# EAGLE design PicoElfIO (EAGLE 4.11)
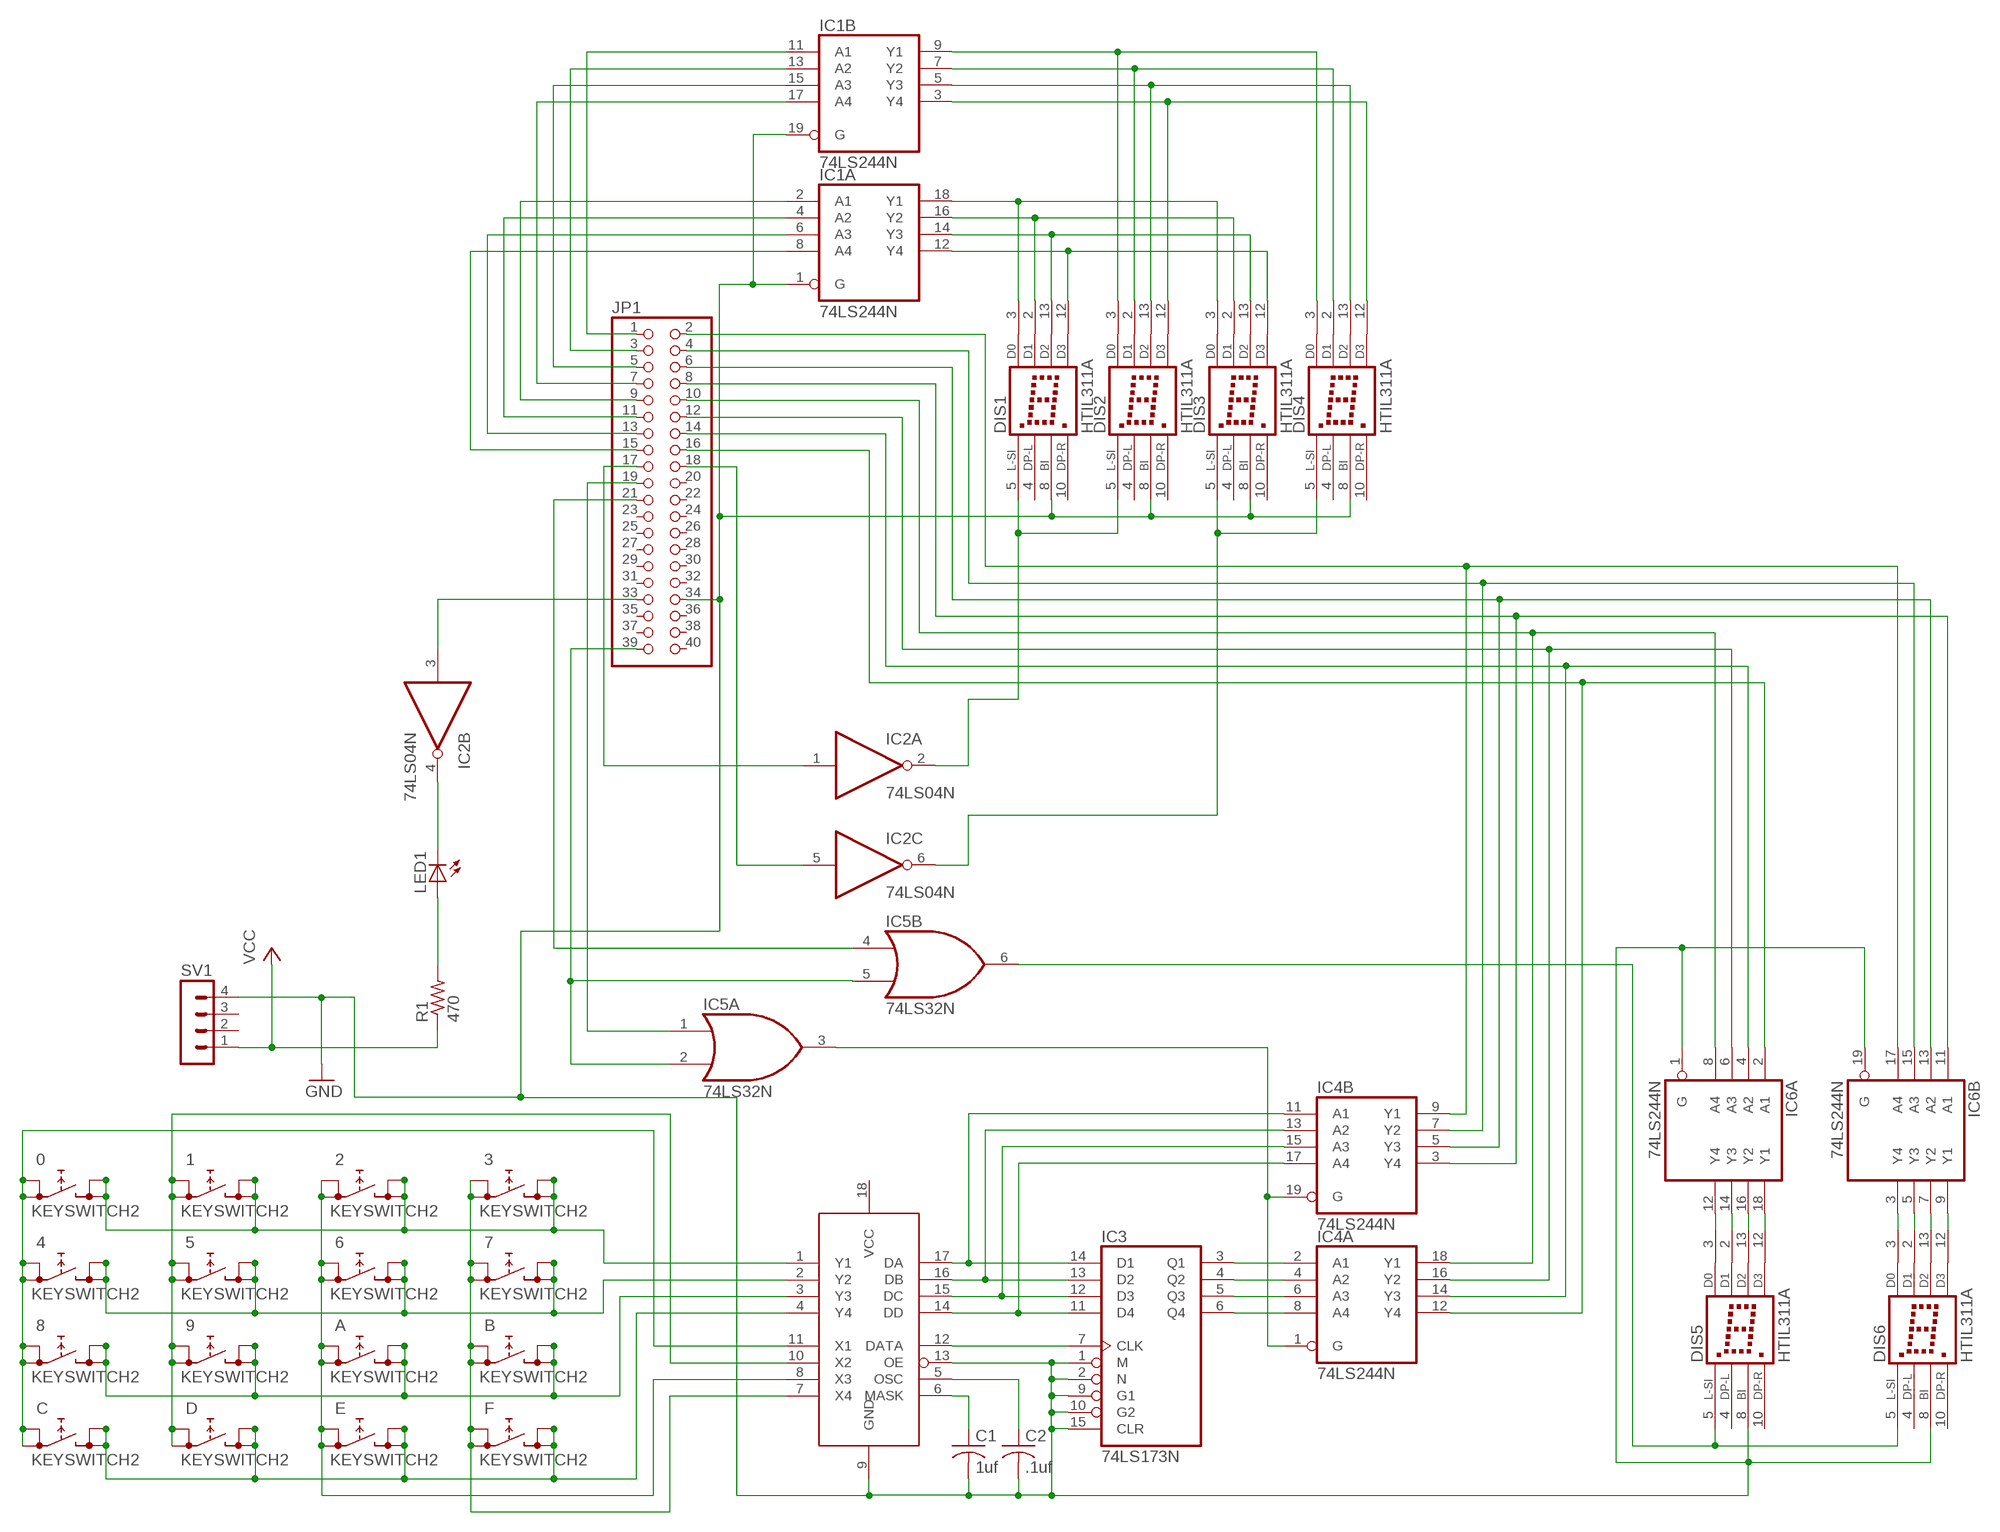
[diagram p0: schematic, sheet 1]

## Parts
0  KEYSWITCH2  [KEY2]
1  KEYSWITCH2  [KEY2]
2  KEYSWITCH2  [KEY2]
3  KEYSWITCH2  [KEY2]
4  KEYSWITCH2  [KEY2]
5  KEYSWITCH2  [KEY2]
6  KEYSWITCH2  [KEY2]
7  KEYSWITCH2  [KEY2]
8  KEYSWITCH2  [KEY2]
9  KEYSWITCH2  [KEY2]
A  KEYSWITCH2  [KEY2]
B  KEYSWITCH2  [KEY2]
C  KEYSWITCH2  [KEY2]
C1  1uf  C-US050-030X075  [C050-030X075]
C2  .1uf  C-US050-030X075  [C050-030X075]
D  KEYSWITCH2  [KEY2]
DIS1  HTIL311A  [HTIL311A]
DIS2  HTIL311A  [HTIL311A]
DIS3  HTIL311A  [HTIL311A]
DIS4  HTIL311A  [HTIL311A]
DIS5  HTIL311A  [HTIL311A]
DIS6  HTIL311A  [HTIL311A]
E  KEYSWITCH2  [KEY2]
F  KEYSWITCH2  [KEY2]
IC1  74LS244N  [DIL20]
IC2  74LS04N  [DIL14]
IC3  74LS173N  [DIL16]
IC4  74LS244N  [DIL20]
IC5  74LS32N  [DIL14]
IC6  74LS244N  [DIL20]
JP1  PINHD-2X20  [2X20]
LED1  LED5MM  [LED5MM]
R1  470  R-US_0204/5  [0204/5]
SV1  MA04-1  [MA04-1]
U$1  74C922  [DIL18]

## Nets
A0: IC1.11(B:A1) JP1.1
A1: IC1.13(B:A2) JP1.3
A2: IC1.15(B:A3) JP1.5
A3: IC1.17(B:A4) JP1.7
A4: IC1.2(A:A1) JP1.9
A5: IC1.4(A:A2) JP1.11
A6: IC1.6(A:A3) JP1.13
A7: IC1.8(A:A4) JP1.15
BA0: DIS2.3(D0) DIS4.3(D0) IC1.9(B:Y1)
BA1: DIS2.2(D1) DIS4.2(D1) IC1.7(B:Y2)
BA2: DIS2.13(D2) DIS4.13(D2) IC1.5(B:Y3)
BA3: DIS2.12(D3) DIS4.12(D3) IC1.3(B:Y4)
BA4: DIS1.3(D0) DIS3.3(D0) IC1.18(A:Y1)
BA5: DIS1.2(D1) DIS3.2(D1) IC1.16(A:Y2)
BA6: DIS1.13(D2) DIS3.13(D2) IC1.14(A:Y3)
BA7: DIS1.12(D3) DIS3.12(D3) IC1.12(A:Y4)
C0: 0.A0 0.A1 4.A0 4.A1 8.A0 8.A1 C.A0 C.A1 U$1.11(X1)
C1: 1.A0 1.A1 5.A0 5.A1 9.A0 9.A1 D.A0 D.A1 U$1.10(X2)
C2: 2.A0 2.A1 6.A0 6.A1 A.A0 A.A1 E.A0 E.A1 U$1.8(X3)
C3: 3.A0 3.A1 7.A0 7.A1 B.A0 B.A1 F.A0 F.A1 U$1.7(X4)
D0: IC4.9(B:Y1) IC6.17(B:A4) JP1.2
D1: IC4.7(B:Y2) IC6.15(B:A3) JP1.4
D2: IC4.5(B:Y3) IC6.13(B:A2) JP1.6
D3: IC4.3(B:Y4) IC6.11(B:A1) JP1.8
D4: IC4.18(A:Y1) IC6.8(A:A4) JP1.10
D5: IC4.16(A:Y2) IC6.6(A:A3) JP1.12
D6: IC4.14(A:Y3) IC6.4(A:A2) JP1.14
D7: IC4.12(A:Y4) IC6.2(A:A1) JP1.16
GND: C1.2 C2.2 DIS1.8(BI) DIS2.8(BI) DIS3.8(BI) DIS4.8(BI) DIS5.8(BI) DIS6.8(BI) IC1.1(A:G) IC1.19(B:G) IC3.1(M) IC3.2(N) IC3.9(G1) IC3.10(G2) IC3.15(CLR) IC6.1(A:G) IC6.19(B:G) JP1.34 SV1.4 U$1.9(GND) U$1.13(OE)
INP: IC5.1(A:I0) JP1.19
N$1: IC3.14(D1) IC4.11(B:A1) U$1.17(DA)
N$2: IC3.13(D2) IC4.13(B:A2) U$1.16(DB)
N$3: IC3.12(D3) IC4.15(B:A3) U$1.15(DC)
N$4: IC3.11(D4) IC4.17(B:A4) U$1.14(DD)
N$5: IC3.7(CLK) U$1.12(DATA)
N$6: IC2.4(B:O) LED1.K(C)
N$7: C1.1 U$1.6(MASK)
N$8: C2.1 U$1.5(OSC)
N$9: IC3.3(Q1) IC4.2(A:A1)
N$10: IC3.4(Q2) IC4.4(A:A2)
N$11: IC3.5(Q3) IC4.6(A:A3)
N$12: IC3.6(Q4) IC4.8(A:A4)
N$13: IC4.1(A:G) IC4.19(B:G) IC5.3(A:O)
N$14: DIS5.5(L-SI) DIS6.5(L-SI) IC5.6(B:O)
N$15: LED1.A R1.2
N$16: DIS5.3(D0) IC6.12(A:Y4)
N$17: DIS5.2(D1) IC6.14(A:Y3)
N$18: DIS5.13(D2) IC6.16(A:Y2)
N$19: DIS5.12(D3) IC6.18(A:Y1)
N$20: DIS6.3(D0) IC6.3(B:Y4)
N$21: DIS6.2(D1) IC6.5(B:Y3)
N$22: DIS6.13(D2) IC6.7(B:Y2)
N$23: DIS6.12(D3) IC6.9(B:Y1)
N$24: IC2.3(B:I) JP1.33
OUT: IC5.4(B:I0) JP1.21
PORT4: IC5.2(A:I1) IC5.5(B:I1) JP1.39
R0: 0.B0 0.B1 1.B0 1.B1 2.B0 2.B1 3.B0 3.B1 U$1.1(Y1)
R1: 4.B0 4.B1 5.B0 5.B1 6.B0 6.B1 7.B0 7.B1 U$1.2(Y2)
R2: 8.B0 8.B1 9.B0 9.B1 A.B0 A.B1 B.B0 B.B1 U$1.3(Y3)
R3: C.B0 C.B1 D.B0 D.B1 E.B0 E.B1 F.B0 F.B1 U$1.4(Y4)
TPA: IC2.1(A:I) JP1.17
TPAI: DIS1.5(L-SI) DIS2.5(L-SI) IC2.2(A:O)
TPB: IC2.5(C:I) JP1.18
TPBI: DIS3.5(L-SI) DIS4.5(L-SI) IC2.6(C:O)
VCC: R1.1 SV1.1
Unconnected: DIS1.4(DP-L) DIS1.10(DP-R) DIS2.4(DP-L) DIS2.10(DP-R) DIS3.4(DP-L) DIS3.10(DP-R) DIS4.4(DP-L) DIS4.10(DP-R) DIS5.4(DP-L) DIS5.10(DP-R) DIS6.4(DP-L) DIS6.10(DP-R) IC2.8(D:O) IC2.9(D:I) IC2.10(E:O) IC2.11(E:I) IC2.12(F:O) IC2.13(F:I) IC5.8(C:O) IC5.9(C:I0) IC5.10(C:I1) IC5.11(D:O) IC5.12(D:I0) IC5.13(D:I1) JP1.20 JP1.22 JP1.23 JP1.24 JP1.25 JP1.26 JP1.27 JP1.28 JP1.29 JP1.30 JP1.31 JP1.32 JP1.35 JP1.36 JP1.37 JP1.38 JP1.40 SV1.2 SV1.3 U$1.18(VCC)

## Power pins joined to a net without a drawn wire
GND: DIS1.7(GND) DIS2.7(GND) DIS3.7(GND) DIS4.7(GND) DIS5.7(GND) DIS6.7(GND) IC1.10(P:GND) IC2.7(P:GND) IC3.8(GND) IC4.10(P:GND) IC5.7(P:GND) IC6.10(P:GND)
VCC: DIS1.14(VCC) DIS2.14(VCC) DIS3.14(VCC) DIS4.14(VCC) DIS5.14(VCC) DIS6.14(VCC) IC1.20(P:VCC) IC2.14(P:VCC) IC3.16(VCC) IC4.20(P:VCC) IC5.14(P:VCC) IC6.20(P:VCC)

## Library data of the parts
0 1-9 A B C D E F = cdp:KEYSWITCH2
C1 C2 = rcl:C-US: CAPACITOR, American symbol
DIS1-DIS6 = display-hp:HTIL311A: LED DISPLAY 1-character dot matrix, 2 decimal points
IC1 IC4 IC6 = 74xx-us:74*244: Octal BUFFER and LINE DRIVER, 3-state
IC2 = 74xx-us:74*04: Hex INVERTER
IC3 = 74xx-us:74*173: 4-bit D type REGISTER, 3-state
IC5 = 74xx-us:74*32: Quad 2-input OR gate
JP1 = pinhead:PINHD-2X20: PIN HEADER
LED1 = led:LED: LED OSRAM: - CHIPLED LG R971, LG N971, LY N971, LG Q971, LY Q971, LO R971, LY R971 LH N974, LH R974 LS Q976, LO Q976, LY Q976 LO Q996 - Hyper CHIPLED LW Q18S LB Q993, LB Q99A, LB R99A - SideLED LS A670, LO A670, LY A670, LG A670, LP A670 LB A673, LV A673, LT A673, LW A673 LH A674 LY A675 LS A676, LA A676, LO A676, LY A676, LW A676 LS A679, LY A679, LG A679 - Hyper Micro SIDELED® LS Y876, LA Y876, LO Y876, LY Y876 LT Y87S - SmartLED LW L88C, LW L88S LB L89C, LB L89S, LG L890 LS L89K, LO L89K, LY L89K LS L896, LA L896, LO L896, LY L896 - TOPLED LS T670, LO T670, LY T670, LG T670, LP T670 LSG T670, LSP T670, LSY T670, LOP T670, LYG T670 LG T671, LOG T671, LSG T671 LB T673, LV T673, LT T673, LW T673 LH T674 LS T676, LA T676, LO T676, LY T676, LB T676, LH T676, LSB T676, LW T676 LB T67C, LV T67C, LT T67C, LS T67K, LO T67K, LY T67K, LW E67C LS E67B, LA E67B, LO E67B, LY E67B, LB E67C, LV E67C, LT E67C LW T67C LS T679, LY T679, LG T679 LS T770, LO T770, LY T770, LG T770, LP T770 LB T773, LV T773, LT T773, LW T773 LH T774 LS E675, LA E675, LY E675, LS T675 LS T776, LA T776, LO T776, LY T776, LB T776 LHGB T686 LT T68C, LB T68C - Hyper Mini TOPLED® LB M676 - Mini TOPLED Santana® LG M470 LS M47K, LO M47K, LY M47K Source: http://www.osram.convergy.de/
R1 = rcl:R-US_: RESISTOR, American symbol
SV1 = con-lstb:MA04-1: PIN HEADER
U$1 = cdp:74C922

## Board
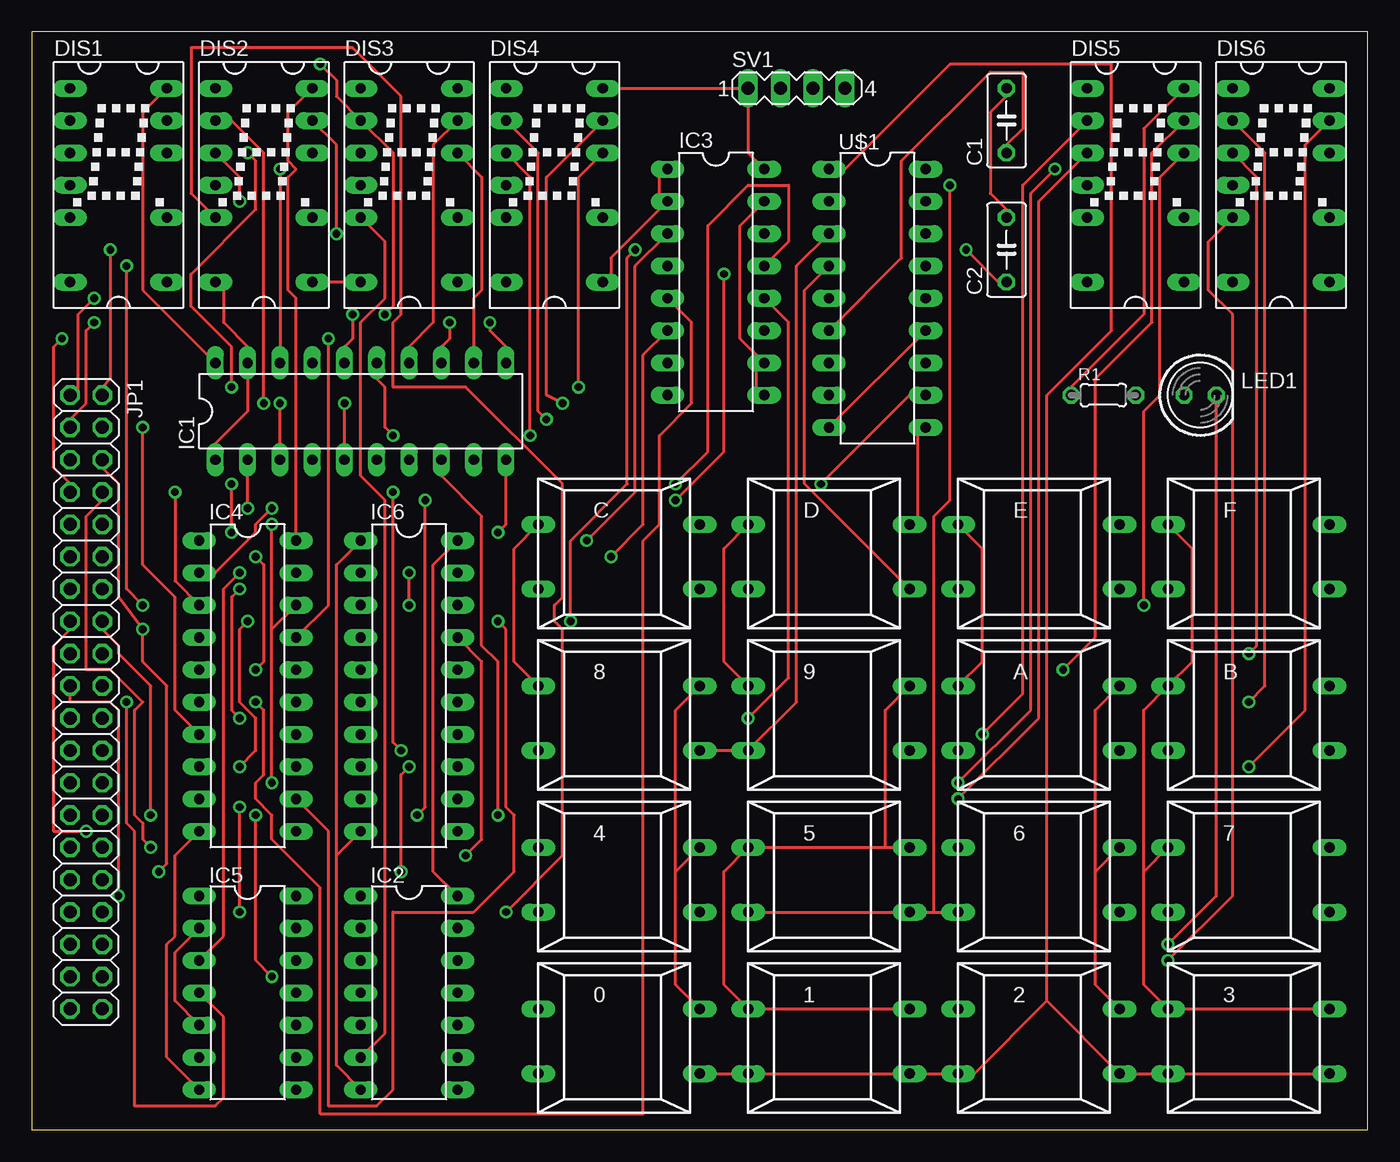
[diagram p1: board, top side]
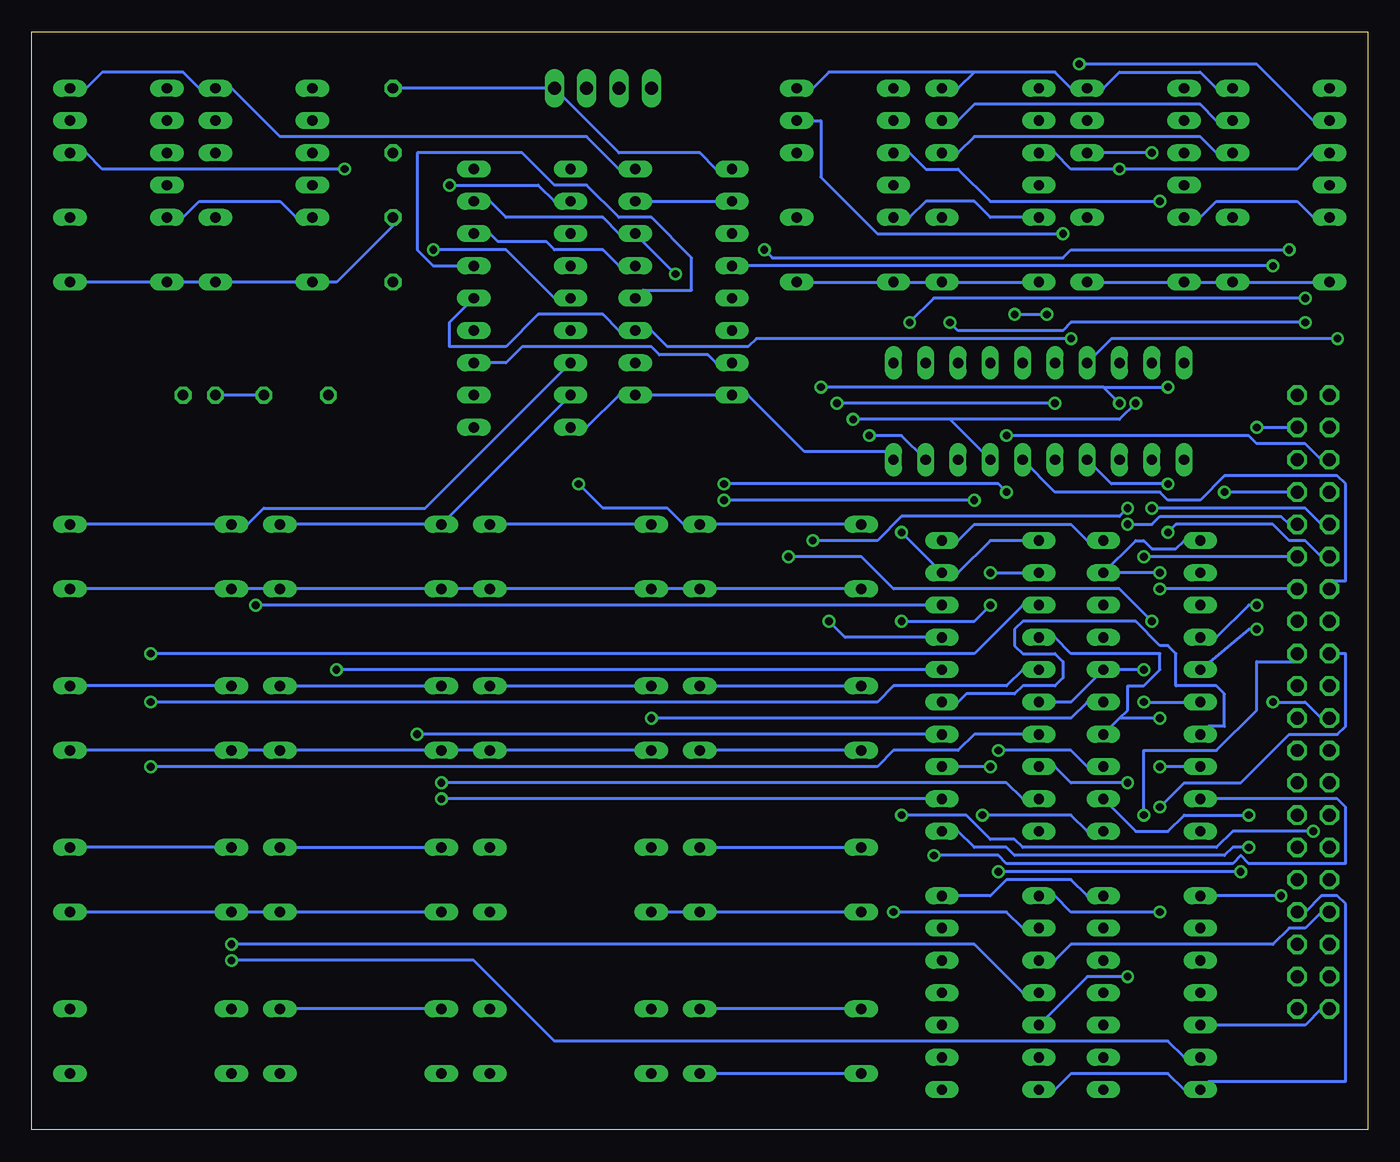
[diagram p2: board, bottom side, seen from below]

Size 105.08 x 86.35 mm. Coordinates in mm from the lower left corner, seen from the top.
Outline: 0,0 105.08,0 105.08,86.35 0,86.35 0,0
Copper layers (1*16): Top 0.035mm / dielectric 1.5mm / Bottom 0.035mm
Design rules "default": minimum track width 10mil, minimum drill 24mil, track to track 8mil, track to pad 8mil, pad to pad 8mil, via to via 8mil, smd to smd 8mil, copper to edge 40mil, drill to drill 8mil, minimum pad ring 10mil, minimum via ring 8mil, stop-mask expansion 4mil, vias tented up to drill 0mil, thermal gap 10mil

### Footprints (pad centres in the part's own frame; a part is rotated, then mirrored left to right if it is on the bottom)
KEY2 = drill 0.813 long: A0 -6.35,2.54; A1 6.35,2.54; B0 -6.35,-2.54; B1 6.35,-2.54
C050-030X075 = drill 0.813 octagon: 1 -2.54,0; 2 2.54,0
HTIL311A = drill 0.813 long: 1 -3.81,7.62; 2 -3.81,5.08; 3 -3.81,2.54; 4 -3.81,0; 5 -3.81,-2.54; 7 -3.81,-7.62; 8 3.81,-7.62; 10 3.81,-2.54; 12 3.81,2.54; 13 3.81,5.08; 14 3.81,7.62
DIL20 = drill 0.813 long: 1 -11.43,-3.81; 2 -8.89,-3.81; 3 -6.35,-3.81; 4 -3.81,-3.81; 5 -1.27,-3.81; 6 1.27,-3.81; 7 3.81,-3.81; 8 6.35,-3.81; 9 8.89,-3.81; 10 11.43,-3.81; 11 11.43,3.81; 12 8.89,3.81; 13 6.35,3.81; 14 3.81,3.81; 15 1.27,3.81; 16 -1.27,3.81; 17 -3.81,3.81; 18 -6.35,3.81; 19 -8.89,3.81; 20 -11.43,3.81
DIL14 = drill 0.813 long: 1 -7.62,-3.81; 2 -5.08,-3.81; 3 -2.54,-3.81; 4 0,-3.81; 5 2.54,-3.81; 6 5.08,-3.81; 7 7.62,-3.81; 8 7.62,3.81; 9 5.08,3.81; 10 2.54,3.81; 11 0,3.81; 12 -2.54,3.81; 13 -5.08,3.81; 14 -7.62,3.81
DIL16 = drill 0.813 long: 1 -8.89,-3.81; 2 -6.35,-3.81; 3 -3.81,-3.81; 4 -1.27,-3.81; 5 1.27,-3.81; 6 3.81,-3.81; 7 6.35,-3.81; 8 8.89,-3.81; 9 8.89,3.81; 10 6.35,3.81; 11 3.81,3.81; 12 1.27,3.81; 13 -1.27,3.81; 14 -3.81,3.81; 15 -6.35,3.81; 16 -8.89,3.81
2X20 = drill 1.016 octagon: 1 -24.13,-1.27; 2 -24.13,1.27; 3 -21.59,-1.27; 4 -21.59,1.27; 5 -19.05,-1.27; 6 -19.05,1.27; 7 -16.51,-1.27; 8 -16.51,1.27; 9 -13.97,-1.27; 10 -13.97,1.27; 11 -11.43,-1.27; 12 -11.43,1.27; 13 -8.89,-1.27; 14 -8.89,1.27; 15 -6.35,-1.27; 16 -6.35,1.27; 17 -3.81,-1.27; 18 -3.81,1.27; 19 -1.27,-1.27; 20 -1.27,1.27; 21 1.27,-1.27; 22 1.27,1.27; 23 3.81,-1.27; 24 3.81,1.27; 25 6.35,-1.27; 26 6.35,1.27; 27 8.89,-1.27; 28 8.89,1.27; 29 11.43,-1.27; 30 11.43,1.27; 31 13.97,-1.27; 32 13.97,1.27; 33 16.51,-1.27; 34 16.51,1.27; 35 19.05,-1.27; 36 19.05,1.27; 37 21.59,-1.27; 38 21.59,1.27; 39 24.13,-1.27; 40 24.13,1.27
LED5MM = drill 0.813 octagon: A -1.27,0; K 1.27,0
0204/5 = drill 0.813 octagon: 1 -2.54,0; 2 2.54,0
MA04-1 = drill 1.016 long: 1 -3.81,0; 2 -1.27,0; 3 1.27,0; 4 3.81,0
DIL18 = drill 0.813 long: 1 -10.16,-3.81; 2 -7.62,-3.81; 3 -5.08,-3.81; 4 -2.54,-3.81; 5 0,-3.81; 6 2.54,-3.81; 7 5.08,-3.81; 8 7.62,-3.81; 9 10.16,-3.81; 10 10.16,3.81; 11 7.62,3.81; 12 5.08,3.81; 13 2.54,3.81; 14 0,3.81; 15 -2.54,3.81; 16 -5.08,3.81; 17 -7.62,3.81; 18 -10.16,3.81

### Placement (x,y rotation side)
0  46.19,6.98 0 top
1  62.7,6.98 0 top
2  79.21,6.98 0 top
3  95.72,6.98 0 top
4  46.19,19.68 0 top
5  62.7,19.68 0 top
6  79.21,19.68 0 top
7  95.72,19.68 0 top
8  46.19,32.38 0 top
9  62.7,32.38 0 top
A  79.21,32.38 0 top
B  95.72,32.38 0 top
C  46.19,45.08 0 top
C1  76.67,79.37 90 top
C2  76.67,69.21 90 top
D  62.7,45.08 0 top
DIS1  6.82,74.29 0 top
DIS2  18.25,74.29 0 top
DIS3  29.68,74.29 0 top
DIS4  41.11,74.29 0 top
DIS5  86.83,74.29 0 top
DIS6  98.26,74.29 0 top
E  79.21,45.08 0 top
F  95.72,45.08 0 top
IC1  25.87,56.51 0 top
IC2  29.68,10.79 270 top
IC3  53.81,66.67 270 top
IC4  16.98,34.92 270 top
IC5  16.98,10.79 270 top
IC6  29.68,34.92 270 top
JP1  4.28,33.65 270 top
LED1  91.91,57.78 0 top
R1  84.29,57.78 0 top
SV1  60.16,81.91 0 top
U$1  66.51,65.4 270 top

### Tracks (layer width: path | path; a pad name or v marks a point on that pad's centre or on a via)
A0  (via drill 0.61)
  Top 0.254: v36.03,63.49 36.03,62.86 37.3,61.59 IC1.11 | v4.92,65.4 3.65,64.13 3.65,57.78 JP1.1
  Bottom 0.254: v36.03,63.49 34.12,65.4 v4.92,65.4
A1  (via drill 0.61)
  Top 0.254: v32.85,63.49 32.85,62.23 32.22,61.59 IC1.13 | v4.92,63.49 4.28,62.86 4.28,57.14 3.01,55.88 JP1.3
  Bottom 0.254: v32.85,63.49 32.22,62.86 23.96,62.86 23.33,63.49 v4.92,63.49
A2  (via drill 0.61)
  Top 0.254: v28.41,54.6 27.77,55.24 27.77,58.41 27.14,59.05 IC1.15
  Bottom 0.254: v28.41,54.6 9.36,54.6 8.72,53.97 4.92,53.97 3.65,52.7 JP1.5
A3  (via drill 0.61)
  Top 0.254: v2.38,62.23 1.74,61.59 1.74,52.06 3.01,50.8 JP1.7
  Bottom 0.254: v2.38,62.23 20.15,62.23 IC1.17
A4  (via drill 0.61)
  Top 0.254: v16.98,48.89 IC1.2
  Bottom 0.254: v16.98,48.89 4.92,48.89 3.65,47.62 JP1.9
A5  (via drill 0.61)
  Top 0.254: v15.71,46.98 v15.71,50.8
  Bottom 0.254: v15.71,50.8 20.15,50.8 IC1.4 | v15.71,46.98 15.08,47.62 7.46,47.62 6.19,46.35 4.92,46.35 3.65,45.08 JP1.11
A6
  Bottom 0.254: IC1.6 24.6,50.16 16.34,50.16 15.71,49.52 13.17,49.52 11.27,51.43 2.38,51.43 1.74,50.8 1.74,43.17 3.01,43.17 JP1.13
A7  (via drill 0.61)
  Top 0.254: v36.66,24.76 36.66,36.82 35.4,38.09 35.4,48.25 32.22,51.43 IC1.8 | v4.28,23.49 1.74,23.49 1.74,38.09 3.01,39.37 JP1.15
  Bottom 0.254: v36.66,24.76 31.58,24.76 29.68,22.85 27.77,22.85 27.14,22.22 11.9,22.22 10.63,23.49 v4.28,23.49
BA0  (via drill 0.61)
  Top 0.254: v39.21,54.6 39.21,74.93 DIS4.3 | v16.34,73.02 16.34,74.93 DIS2.3
  Bottom 0.254: v39.21,54.6 36.66,54.6 IC1.9 | v16.34,73.02 29.68,73.02 32.22,75.56 34.76,75.56 36.03,76.83 DIS4.3
BA1  (via drill 0.61)
  Top 0.254: v40.48,55.88 39.84,56.51 39.84,76.83 DIS4.2 | v18.25,57.14 18.25,76.83 15.71,79.37 DIS2.2
  Bottom 0.254: 32.85,55.88 v40.48,55.88 | 32.85,55.88 IC1.7 | v18.25,57.14 19.52,55.88 32.85,55.88
BA2  (via drill 0.61)
  Top 0.254: v41.75,57.14 40.48,57.78 40.48,74.93 DIS4.13 | IC1.5 v24.6,57.14 | v23.96,70.48 23.96,77.47 DIS2.13
  Bottom 0.254: v24.6,57.14 v41.75,57.14 | v23.96,70.48 38.57,70.48 43.02,74.93 43.02,79.37 DIS4.13
BA3  (via drill 0.61)
  Top 0.254: v43.02,58.41 43.02,74.93 DIS4.12 | IC1.3 v19.52,57.14 | v16.98,76.83 17.61,76.2 17.61,72.39 12.54,67.31 12.54,64.77 15.71,61.59 v15.71,58.41
  Bottom 0.254: v19.52,57.14 20.79,58.41 | 20.79,58.41 v43.02,58.41 | 20.79,58.41 v15.71,58.41 | v16.98,76.83 DIS2.12
BA4  (via drill 0.61)
  Top 0.254: v19.52,75.56 IC1.18
  Bottom 0.254: DIS3.3 24.6,76.83 23.33,75.56 v19.52,75.56 5.55,75.56 4.28,76.83 DIS1.3
BA5  (via drill 0.61)
  Top 0.254: v22.69,83.82 23.96,82.55 23.96,81.28 DIS3.2 28.41,76.83 28.41,64.77 v27.77,64.13 | v25.23,64.13 25.23,62.23 24.6,61.59 IC1.16
  Bottom 0.254: v22.69,83.82 8.72,83.82 4.28,79.37 DIS1.2 | v27.77,64.13 v25.23,64.13
BA6
  Top 0.254: IC1.14 29.68,61.59 31.58,63.49 31.58,77.47 DIS3.13
  Bottom 0.254: DIS1.13 11.9,79.37 13.17,80.64 30.95,80.64 32.22,79.37 DIS3.13
BA7
  Top 0.254: IC1.12 34.76,65.4 35.4,66.04 35.4,74.93 DIS3.12
  Bottom 0.254: DIS1.12 11.9,76.83 13.17,78.1 30.95,78.1 32.22,76.83 DIS3.12
C0  (via drill 0.61)
  Top 0.254: 50.64,20.31 50.64,11.43 0.A1 | 50.64,20.31 4.A1 | 50.64,20.31 50.64,33.02 8.A1 | v62.07,50.8 69.05,57.78 U$1.11 | 8.A0 37.94,36.82 37.94,45.71 C.A0
  Bottom 0.254: 8.A1 8.A0 | 0.A0 0.A1 | 4.A1 4.A0 | C.A0 C.A1 53.81,47.62 55.08,48.89 60.16,48.89 v62.07,50.8
C1
  Top 0.254: U$1.10 69.68,54.6 69.68,48.25 D.A1 | 1.A1 1.A0 54.45,11.43 54.45,20.31 5.A0 67.14,22.22 | 67.14,22.22 5.A1 | 67.14,22.22 67.14,33.02 9.A1 | D.A0 54.45,45.71 54.45,36.82 9.A0
  Bottom 0.254: D.A0 D.A1 | 9.A1 9.A0
C2
  Top 0.254: 83.66,20.31 83.66,11.43 2.A1 | 83.66,20.31 6.A1 | 83.66,20.31 83.66,33.02 A.A1 | E.A0 74.77,45.71 74.77,36.82 A.A0
  Bottom 0.254: E.A1 E.A0 U$1.8 | A.A1 A.A0 | 2.A0 2.A1 | 6.A1 6.A0
C3
  Top 0.254: 3.A1 3.A0 87.46,11.43 87.46,20.31 | 87.46,20.31 7.A0 | 87.46,20.31 87.46,33.02 B.A0 91.27,36.82 91.27,45.71 F.A0
  Bottom 0.254: B.A0 B.A1 | 7.A0 7.A1 | F.A1 F.A0 88.1,47.62 86.83,48.89 74.13,48.89 U$1.7
D0  (via drill 0.61)
  Top 0.254: v34.12,21.58 35.4,22.85 35.4,36.82 IC6.17 | v6.19,69.21 6.19,59.05 5.55,58.41 JP1.2 | v47.46,69.21 46.83,68.58 46.83,50.8 42.38,46.35 v42.38,40
  Bottom 0.254: v34.12,21.58 29.04,21.58 28.41,20.95 10.63,20.95 10,21.58 9.36,20.95 1.74,20.95 1.74,25.39 2.38,26.03 IC4.9 | v6.19,69.21 23.33,69.21 23.96,68.58 46.83,68.58 v47.46,69.21 | v42.38,40 41.11,38.73 IC6.17
D1  (via drill 0.61)
  Top 0.254: v8.72,55.24 8.72,44.45 11.27,41.91 11.27,33.02 IC4.7
  Bottom 0.254: v8.72,55.24 JP1.4 | IC6.15 32.22,33.65 31.58,34.28 27.77,34.28 27.14,34.92 24.6,34.92 23.96,35.55 23.96,36.82 24.6,37.46 27.14,37.46 27.77,38.09 27.77,39.37 27.14,40 18.25,40 16.34,38.09 15.71,38.09 15.08,37.46 15.08,34.92 11.9,34.92 11.27,34.28 11.27,31.74 12.54,31.74 IC4.7
D2  (via drill 0.61)
  Top 0.254: JP1.6 5.55,52.06 6.82,50.8 6.82,41.91 v8.72,39.37 8.72,36.82 10.63,34.92 10.63,20.95 v10,20.31 | v29.68,28.57 29.04,27.93 v29.04,20.31
  Bottom 0.254: v8.72,39.37 9.36,39.37 IC4.5 | v10,20.31 v29.04,20.31 | v29.68,28.57 IC6.13
D3  (via drill 0.61)
  Top 0.254: v11.27,50.16 11.27,43.17 IC4.3 | v9.36,22.22 8.72,22.85 8.72,24.12 8.09,24.76 8.09,33.02 8.72,33.65 6.19,36.19 4.28,36.19 4.28,48.25 5.55,49.52 JP1.8
  Bottom 0.254: JP1.8 v11.27,50.16 | v9.36,22.22 10.63,22.22 11.27,21.58 27.77,21.58 28.41,22.22 30.95,22.22 32.22,23.49 IC6.11
D4  (via drill 0.61)
  Top 0.254: v18.88,27.3 18.88,39.37 | 18.88,39.37 IC4.18 | 18.88,39.37 v18.88,47.62
  Bottom 0.254: v18.88,27.3 23.33,27.3 24.6,28.57 IC6.8 | v18.88,47.62 16.98,47.62 16.34,48.25 6.82,48.25 6.19,47.62 JP1.10
D5  (via drill 0.61)
  Top 0.254: v17.61,45.08 18.25,44.45 18.25,36.82 v17.61,36.19
  Bottom 0.254: IC6.6 23.33,33.65 IC4.16 v17.61,36.19 | JP1.12 v17.61,45.08
D6  (via drill 0.61)
  Top 0.254: v16.34,42.54 15.71,41.91 15.71,33.02 v16.34,32.38
  Bottom 0.254: 19.52,32.38 18.88,33.02 18.88,34.92 17.61,34.92 16.34,36.19 16.34,37.46 23.33,37.46 24.6,38.73 IC6.4 | 19.52,32.38 IC4.14 | v16.34,32.38 19.52,32.38 | JP1.14 v16.34,42.54
D7  (via drill 0.61)
  Top 0.254: v9.36,24.76 9.36,34.92 6.82,37.46 6.82,38.09 5.55,39.37 JP1.16 | v29.68,41.27 v29.68,43.81 | v36.66,40 37.3,39.37 37.3,25.39 37.94,24.76 37.94,20.31 34.76,17.14 28.41,17.14 28.41,3.17 27.14,1.9 23.33,1.9 23.33,23.49 IC4.12
  Bottom 0.254: v9.36,24.76 14.44,24.76 15.71,23.49 18.25,23.49 IC4.12 | v29.68,41.27 30.95,40 v36.66,40 | v29.68,43.81 IC6.2
GND  (via drill 0.61)
  Top 0.254: IC4.10 11.27,21.58 11.27,15.24 10.63,14.6 10.63,5.71 IC5.7 | 23.96,21.58 23.96,5.07 IC2.7 | 23.96,21.58 IC6.10 | 23.96,21.58 23.96,44.45 IC6.1 | C1.2 76.67,81.28 75.4,80.01 75.4,73.66 76.67,72.39 C2.2 | IC3.9 56.98,58.41 56.98,59.68 IC3.10 55.72,62.23 55.72,71.12 IC3.15 | U$1.9 U$1.13 | IC3.1 49.37,74.93 49.37,73.66 IC3.2 45.55,68.58 45.55,67.31 DIS4.8 | IC1.1 14.44,53.97 16.98,56.51 IC1.19 16.98,61.59 15.08,63.49 15.08,66.04 DIS2.7 | DIS3.7 DIS2.8 | v36.66,46.98 37.3,47.62 IC1.10
  Bottom 0.254: IC6.1 29.68,46.35 32.22,43.81 IC6.19 v36.66,46.98 | IC2.7 24.6,3.17 23.33,4.44 15.71,4.44 14.44,3.17 IC5.7 12.54,3.8 1.74,3.8 1.74,17.77 2.38,18.41 3.65,18.41 4.92,17.14 JP1.34 | C1.2 SV1.4 58.89,76.83 52.54,76.83 51.27,75.56 IC3.1 | C2.2 76.67,71.12 81.11,66.67 DIS5.7 DIS5.8 DIS6.7 DIS6.8 | IC1.10 37.94,53.34 44.29,53.34 48.73,57.78 IC3.8 IC3.9 58.89,57.78 61.43,55.24 U$1.9 | IC3.15 IC3.2 | DIS4.8 DIS4.7 DIS3.8 DIS3.7 | DIS1.7 DIS1.8 DIS2.7 DIS2.8
INP  (via drill 0.61)
  Top 0.254: v6.82,18.41 6.82,33.02 6.19,33.65 3.01,33.65 JP1.19
  Bottom 0.254: v6.82,18.41 IC5.1
N$1  (via drill 0.61)
  Top 0.254: v30.31,24.76 30.95,25.39 v30.95,49.52 | v50.64,49.52 54.45,53.34 v54.45,67.31
  Bottom 0.254: v30.31,24.76 23.33,24.76 22.06,23.49 IC4.11 | v30.95,49.52 v50.64,49.52 | v54.45,67.31 IC3.14 58.89,70.48 60.16,71.75 67.78,71.75 69.05,73.02 U$1.17
N$2  (via drill 0.61)
  Top 0.254: v29.04,29.84 28.41,30.47 v28.41,50.16 | v50.64,50.8 53.18,53.34 53.18,71.12 56.35,74.29 59.52,74.29 59.52,69.84 IC3.13
  Bottom 0.254: v29.04,29.84 23.33,29.84 22.06,28.57 IC4.13 | v28.41,50.16 29.04,50.8 v50.64,50.8 | U$1.16 69.05,70.48 68.41,69.84 64.61,69.84 63.97,69.21 60.16,69.21 58.89,67.94 IC3.13
N$3  (via drill 0.61)
  Top 0.254: v56.35,32.38 59.52,35.55 59.52,63.49 IC3.12
  Bottom 0.254: v56.35,32.38 23.33,32.38 22.06,33.65 IC4.15 | U$1.15 73.49,67.94 74.77,69.21 74.77,76.83 66.51,76.83 63.97,74.29 61.43,74.29 58.89,71.75 56.35,71.75 53.18,68.58 53.18,66.04 56.98,66.04 IC3.12
N$4  (via drill 0.61)
  Top 0.254: v23.33,62.23 23.33,41.27 IC4.17
  Bottom 0.254: v23.33,62.23 48.09,62.23 48.73,61.59 55.08,61.59 56.35,62.86 IC3.11 58.89,62.86 60.16,64.13 65.24,64.13 67.78,61.59 72.22,61.59 72.22,63.49 U$1.14
N$5
  Bottom 0.254: IC3.7 51.27,60.32 51.91,60.95 55.72,60.95 56.35,61.59 66.51,61.59 67.78,60.32 U$1.12
N$6  (via drill 0.61)
  Top 0.254: v89.37,14.6 93.18,18.41 LED1.K
  Bottom 0.254: v89.37,14.6 30.95,14.6 27.14,10.79 IC2.4
N$7
  Top 0.254: U$1.6 68.41,68.58 68.41,76.2 75.4,83.18 77.94,83.18 77.94,78.73 76.67,77.47 C1.1
N$8  (via drill 0.61)
  Top 0.254: v73.49,69.21 76.03,66.67 C2.1
  Bottom 0.254: v73.49,69.21 67.78,69.21 63.97,65.4 U$1.5
N$9  (via drill 0.61)
  Top 0.254: v18.88,48.89 17.61,47.62 17.61,46.98 14.44,43.81 IC4.2 | v43.65,46.35 47.46,50.16 47.46,67.94 IC3.3
  Bottom 0.254: v18.88,48.89 19.52,48.25 36.66,48.25 38.57,46.35 v43.65,46.35
N$10  (via drill 0.61)
  Top 0.254: v8.72,41.27 7.46,42.54 v7.46,67.94
  Bottom 0.254: v8.72,41.27 9.36,41.27 11.9,38.73 IC4.4 | v7.46,67.94 IC3.4
N$11  (via drill 0.61)
  Top 0.254: v17.61,33.65 18.25,33.02 18.25,27.93 17.61,27.3 17.61,26.03 18.88,24.76 18.88,22.85 22.69,19.04 22.69,1.26 48.09,1.26 48.09,46.35 49.37,47.62 49.37,54.6 51.91,57.14 51.91,63.49 IC3.5
  Bottom 0.254: v17.61,33.65 IC4.6
N$12  (via drill 0.61)
  Top 0.254: v16.34,28.57 17.61,29.84 17.61,32.38 16.34,33.65 16.34,39.37 v16.98,40 | v45.55,45.08 48.09,47.62 48.09,60.95 IC3.6
  Bottom 0.254: v16.98,40 19.52,42.54 37.3,42.54 39.84,45.08 v45.55,45.08 | IC4.8 v16.34,28.57
N$13  (via drill 0.61)
  Top 0.254: v16.34,43.81 15.08,42.54 15.08,15.24 IC5.3
  Bottom 0.254: v16.34,43.81 IC4.19 18.25,46.35 17.61,46.35 16.98,45.71 15.08,45.71 14.44,46.35 IC4.1
N$14  (via drill 0.61)
  Top 0.254: v89.37,13.33 94.45,18.41 94.45,64.13 92.55,66.04 92.55,69.84 DIS6.5
  Bottom 0.254: v89.37,13.33 70.32,13.33 63.97,6.98 15.71,6.98 14.44,5.71 IC5.6 | DIS5.5 84.29,71.75 85.56,73.02 91.91,73.02 93.18,71.75 DIS6.5
N$15
  Bottom 0.254: R1.2 LED1.A
N$16  (via drill 0.61)
  Top 0.254: v72.86,26.03 79.21,32.38 79.21,73.02 DIS5.3
  Bottom 0.254: IC6.12 v72.86,26.03
N$17  (via drill 0.61)
  Top 0.254: v74.77,31.11 77.94,34.28 77.94,74.29 DIS5.2
  Bottom 0.254: IC6.14 v74.77,31.11
N$18  (via drill 0.61)
  Top 0.254: v81.11,36.19 83.66,38.73 83.66,59.05 88.1,63.49 88.1,76.83 DIS5.13
  Bottom 0.254: IC6.16 v81.11,36.19
N$19  (via drill 0.61)
  Top 0.254: v87.46,41.27 87.46,56.51 88.73,57.78 88.73,74.93 DIS5.12
  Bottom 0.254: IC6.18 v87.46,41.27
N$20  (via drill 0.61)
  Top 0.254: v95.72,37.46 96.35,38.09 96.35,74.93 DIS6.3
  Bottom 0.254: v95.72,37.46 30.95,37.46 27.14,41.27 IC6.3
N$21  (via drill 0.61)
  Top 0.254: v95.72,33.65 96.99,34.92 96.99,76.83 DIS6.2
  Bottom 0.254: v95.72,33.65 38.57,33.65 37.3,34.92 28.41,34.92 27.14,36.19 IC6.5
N$22  (via drill 0.61)
  Top 0.254: v95.72,28.57 100.16,33.02 100.16,77.47 DIS6.13
  Bottom 0.254: v95.72,28.57 38.57,28.57 37.3,29.84 32.22,29.84 30.95,31.11 IC6.7
N$23  (via drill 0.61)
  Top 0.254: v72.86,27.3 78.57,33.02 78.57,73.66 v80.48,75.56
  Bottom 0.254: v72.86,27.3 28.41,27.3 27.14,26.03 IC6.9 | v80.48,75.56 99.53,75.56 100.8,76.83 DIS6.12
N$24
  Bottom 0.254: IC2.3 24.6,13.33 23.33,14.6 7.46,14.6 6.19,15.87 4.92,15.87 3.65,17.14 JP1.33
OUT  (via drill 0.61)
  Top 0.254: v7.46,33.65 7.46,24.12 8.09,23.49 8.09,1.9 14.44,1.9 15.08,2.54 15.08,8.88 IC5.4
  Bottom 0.254: v7.46,33.65 4.92,33.65 3.65,32.38 JP1.21
PORT4
  Top 0.254: IC5.5 11.27,10.16 11.27,13.96 IC5.2
  Bottom 0.254: JP1.39 3.65,9.52 4.92,8.25 IC5.5
R0
  Top 0.254: 0.B1 1.B0 1.B1 2.B0 74.13,4.44 79.84,10.16 | 3.B1 3.B0 2.B1 79.84,10.16 | 79.84,10.16 79.84,57.78 84.92,62.86 84.92,83.82 72.22,83.82 63.97,75.56 U$1.1
  Bottom 0.254: 0.B0 0.B1
R1  (via drill 0.61)
  Top 0.254: 70.95,17.14 5.B1 5.B0 | 70.95,17.14 6.B0 | v72.22,74.29 72.22,49.52 70.95,48.25 70.95,17.14
  Bottom 0.254: 7.B1 7.B0 6.B1 6.B0 | 4.B0 4.B1 5.B0 | v72.22,74.29 65.24,74.29 63.97,73.02 U$1.2
R2
  Top 0.254: 8.B1 9.B0 60.16,33.65 60.16,67.94 U$1.3
  Bottom 0.254: B.B1 B.B0 A.B1 A.B0 9.B1 9.B0 | 8.B0 8.B1
R3
  Top 0.254: U$1.4 60.8,66.04 60.8,50.8 D.B1
  Bottom 0.254: F.B1 F.B0 E.B1 E.B0 D.B1 D.B0 C.B1 C.B0
TPA  (via drill 0.61)
  Top 0.254: v16.34,17.14 v16.34,25.39
  Bottom 0.254: v16.34,17.14 23.33,17.14 24.6,18.41 IC2.1 | v16.34,25.39 14.44,27.3 10,27.3 6.19,31.11 2.38,31.11 1.74,31.74 1.74,37.46 JP1.17
TPAI  (via drill 0.61)
  Top 0.254: v37.3,17.14 41.75,21.58 41.75,39.37 41.11,40 41.11,41.27 41.75,41.91 41.75,50.8 34.12,58.41 28.41,58.41 28.41,63.49 29.04,64.13 29.04,81.28 25.23,85.09 12.54,85.09 12.54,73.66 DIS2.5
  Bottom 0.254: DIS1.5 4.28,71.75 5.55,73.02 11.9,73.02 13.17,71.75 DIS2.5 | v37.3,17.14 28.41,17.14 27.14,15.87 IC2.2
TPB  (via drill 0.61)
  Top 0.254: v18.88,12.06 17.61,13.33 v17.61,24.76
  Bottom 0.254: v18.88,12.06 22.06,12.06 IC2.5 | v17.61,24.76 17.61,29.84 11.9,29.84 8.72,33.02 8.72,36.82 5.55,36.82 JP1.18
TPBI
  Top 0.254: IC2.6 27.77,7.62 27.77,49.52 25.87,51.43 25.87,63.49 27.77,65.4 27.77,69.84 DIS3.5
  Bottom 0.254: DIS4.5 36.03,71.75 34.76,73.02 30.95,73.02 29.68,71.75 DIS3.5
VCC
  Top 0.254: R1.1 81.75,58.41 87.46,64.13 87.46,78.73 DIS5.14 | IC2.14 31.58,20.31 31.58,44.45 IC6.20 | DIS4.14 SV1.1 56.35,76.83 IC3.16 | IC1.20 8.72,66.04 8.72,80.01 DIS1.14 | IC4.20 20.79,65.4 20.15,66.04 20.15,74.93 20.79,75.56 20.15,76.2 20.15,80.01 DIS2.14
  Bottom 0.254: DIS6.14 100.8,81.91 99.53,83.18 93.18,83.18 91.91,81.91 DIS5.14 89.37,81.91 85.56,78.1 61.43,78.1 58.89,75.56 IC3.16 | IC5.14 22.06,18.41 23.33,19.68 28.41,19.68 29.68,18.41 IC2.14 | IC4.20 22.06,46.35 23.33,47.62 30.95,47.62 32.22,46.35 IC6.20 | DIS1.14 11.9,81.91 13.17,83.18 19.52,83.18 20.79,81.91 DIS2.14 23.33,81.91 24.6,83.18 30.95,83.18 | 30.95,83.18 32.22,81.91 DIS3.14 | 30.95,83.18 42.38,83.18 43.65,81.91 DIS4.14